# Altium schematic sheet Booster_scheme_transformator.SchDoc
size 420 x 297 mm; DocumentNumber: Введите номер платы + Э3; SheetNumber: номер страницы; Format: A3
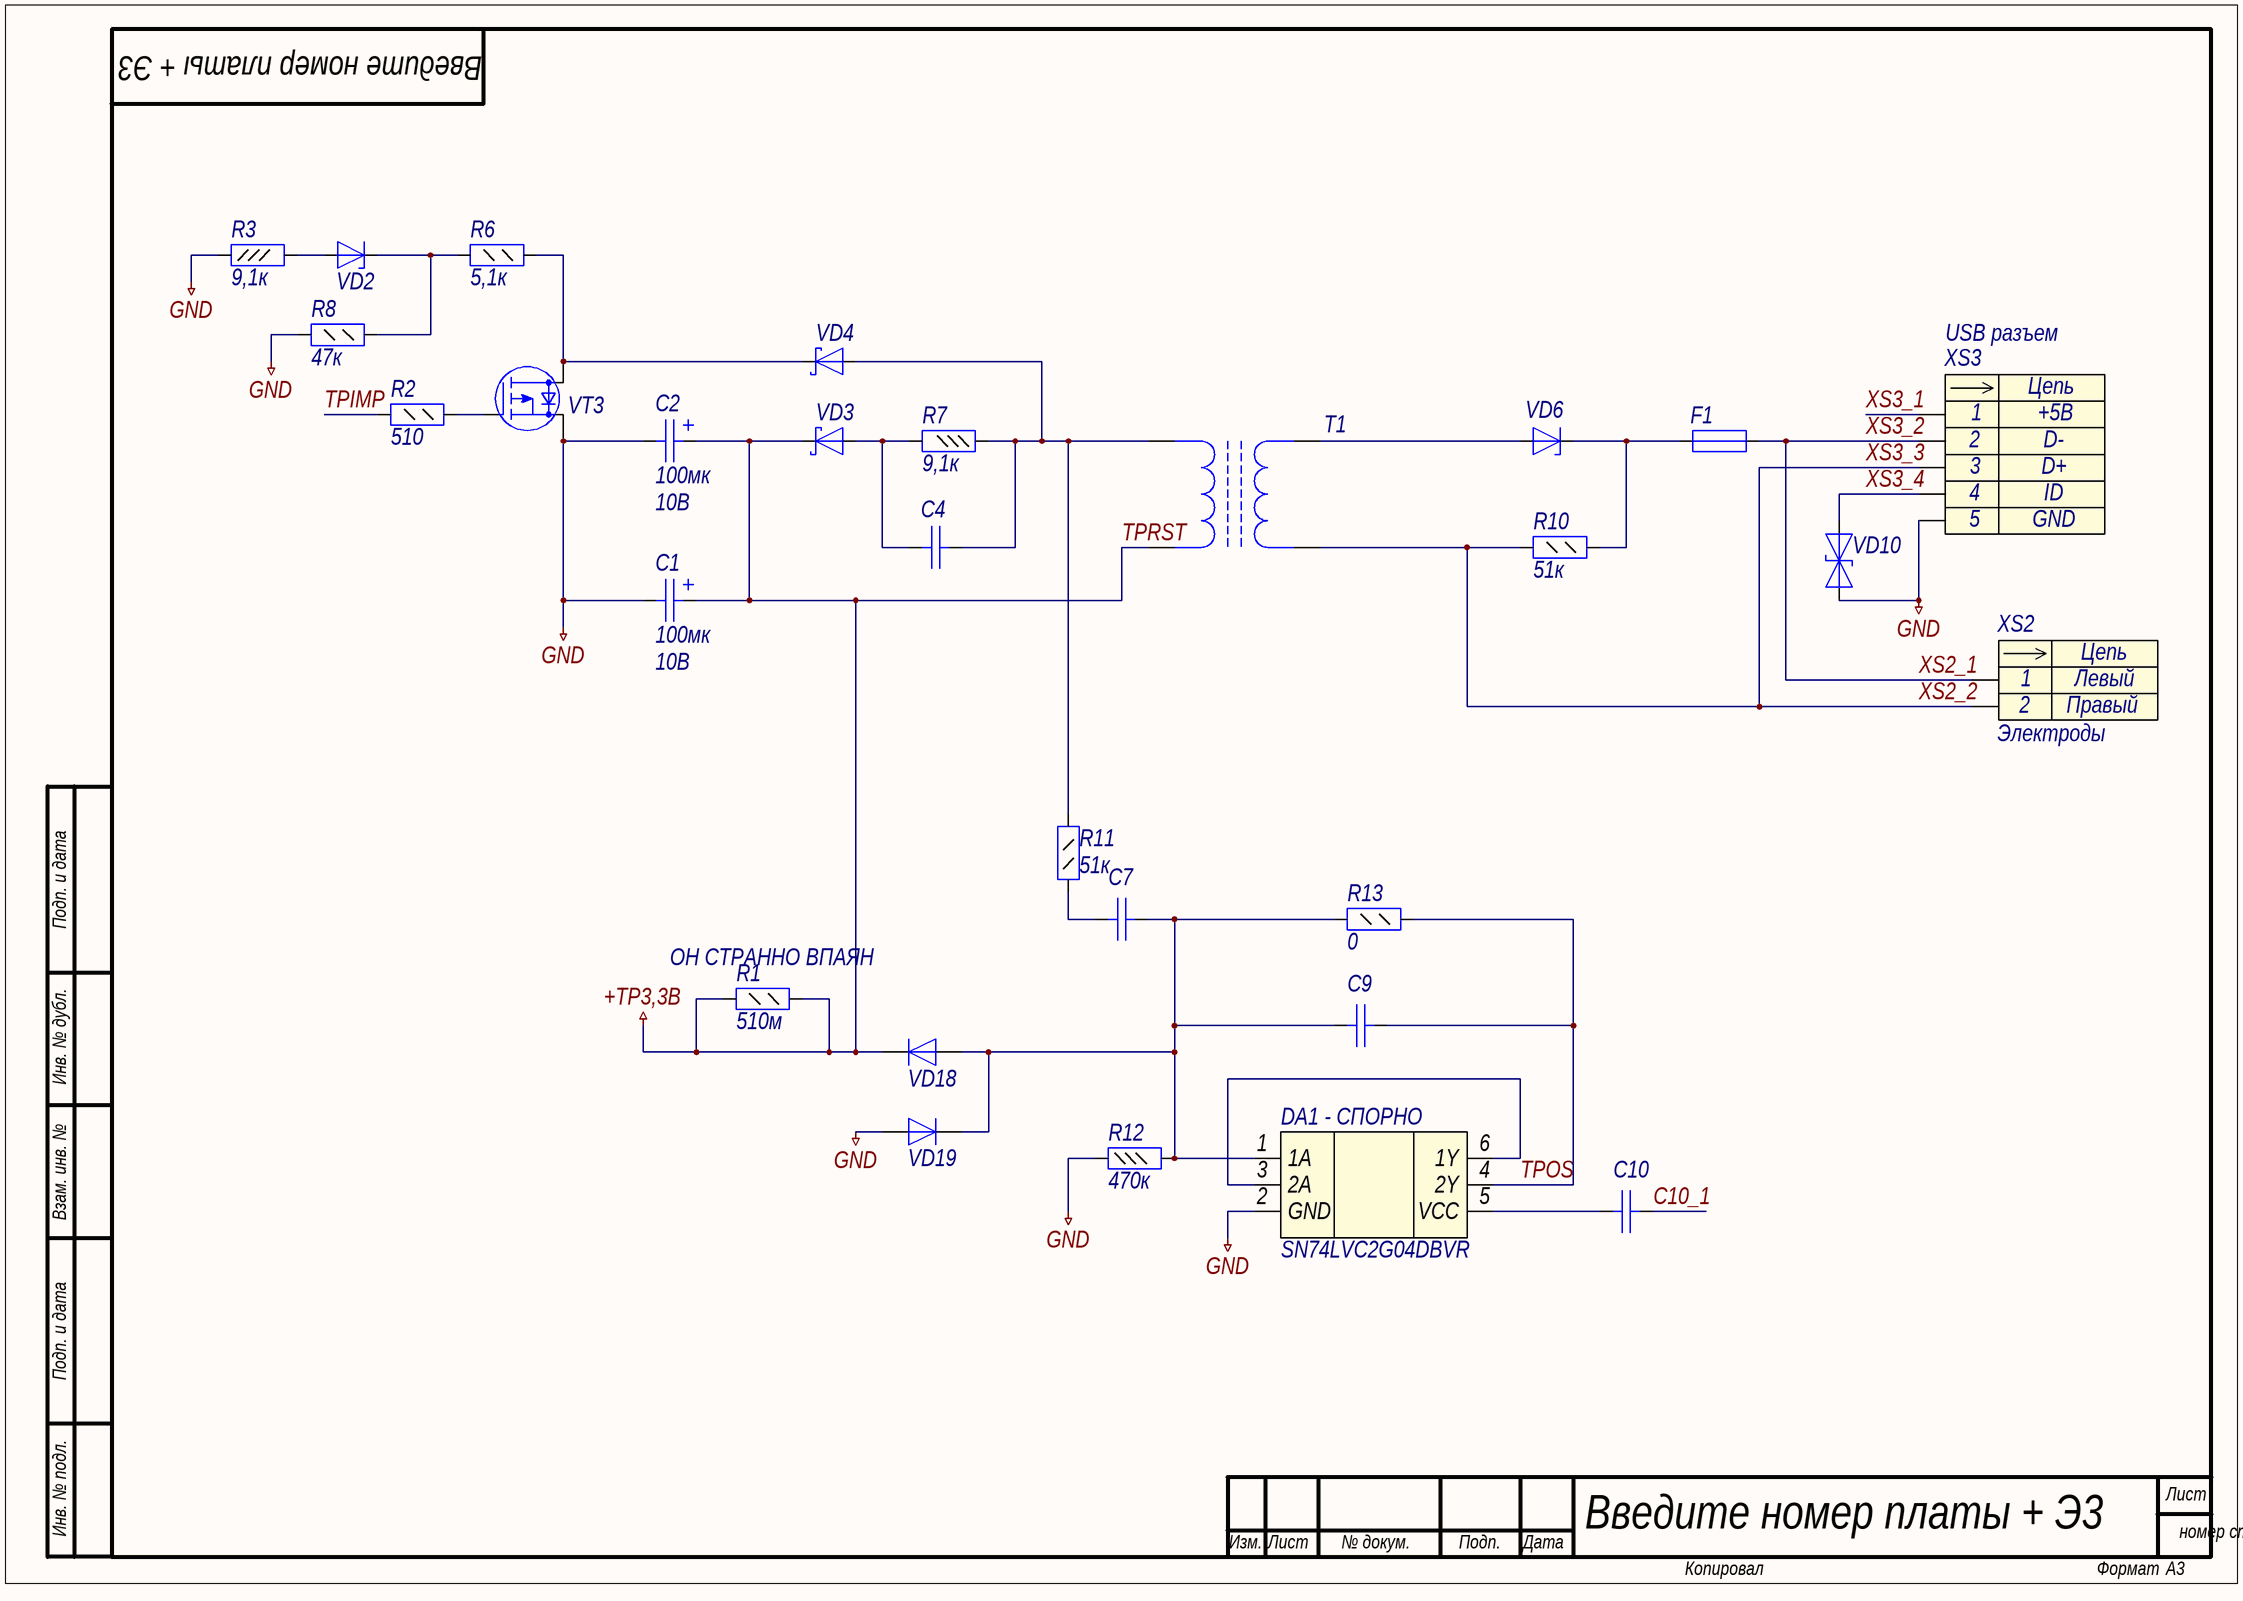
[diagram p0: Booster_scheme_transformator.SchDoc]

## Parts
C1  value 100мк  Voltage: 10В  [TANTAL CASE D]  (hidden comment: Capacitor_pol)
C2  value 100мк  Voltage: 10В  [TANTAL CASE D]  (hidden comment: Capacitor_pol)
C4  Capacitor  [C0402]  (value not drawn)
C7  Capacitor  [C0402]  (value not drawn)
C9  Capacitor  [C0402]  (value not drawn)
C10  Capacitor  [C0402]  (value not drawn)
DA1_-_СПОРНО  SN74LVC2G04DBVR  [SOT23-6]
F1  Fuse  [FUSE812]  (value not drawn)
R1  value 510м  [R0805]  (hidden comment: Resistor_0,125Вт)
R2  value 510  [R0805]  (hidden comment: Resistor_0,125Вт)
R3  value 9,1к  [R0603]  (hidden comment: Resistor_0,062Вт)
R6  value 5,1к  [R0805]  (hidden comment: Resistor_0,125Вт)
R7  value 9,1к  [R0603]  (hidden comment: Resistor_0,062Вт)
R8  value 47к  [R0805]  (hidden comment: Resistor_0,125Вт)
R10  value 51к  [R0805]  (hidden comment: Resistor_0,125Вт)
R11  value 51к  [R0805]  (hidden comment: Resistor_0,125Вт)
R12  value 470к  [R0603]  (hidden comment: Resistor_0,062Вт)
R13  value 0  [R0805]  (hidden comment: Resistor_0,125Вт)
T1  Transformer  [Transformer36mm]  (value not drawn)
VD2  DiodeZener  [SOT23-3]  (value not drawn)
VD3  DiodeSchottky  [SOD-123]  (value not drawn)
VD4  DiodeSchottky  [SOD-123]  (value not drawn)
VD6  DiodeZener  [SOT23-3]  (value not drawn)
VD10  DiodeZenerDual  [SMB]  (value not drawn)
VD18  Diode  [SOD-123]  (value not drawn)
VD19  Diode  [SOD-123]  (value not drawn)
VT3  P-MOSFET  [SOT23-3]  (value not drawn)
XS2  Электроды  [CWF-2]
XS3  USB разъем  [USB MINI AB RECEPTACLE]

## Nets
GND: C1.2 C2.2 DA1_-_СПОРНО.2(GND) R3.1 R8.2 R12.1 VD10.1(K) VD19.2(A) VT3.3(S) XS3.5
TPRST: C1.1 C2.1 R1.1 R1.2 T1.2 VD3.1(K) VD18.1(K)  [also labelled +TP3,3В]
C10_1: C10.1
TPIMP: R2.2
TPOS: C9.2 DA1_-_СПОРНО.4(2Y) R13.1
XS2_1: F1.1 XS2.1 XS3.2  [also labelled XS3_2]
XS2_2: R10.2 T1.4 XS2.2 XS3.3  [also labelled XS3_3]
XS3_1: XS3.1
XS3_4: VD10.2(A) XS3.4
NetC4_1: C4.1 R7.1 R11.2 T1.1 VD4.2(A)
NetC4_2: C4.2 R7.2 VD3.2(A)
NetC7_1: C7.1 C9.1 DA1_-_СПОРНО.1(1A) R12.2 R13.2 VD18.2(A) VD19.1(K)
NetC7_2: C7.2 R11.1
NetC10_2: C10.2 DA1_-_СПОРНО.5(VCC)
NetDA1_-_СПОРНО_3: DA1_-_СПОРНО.3(2A) DA1_-_СПОРНО.6(1Y)
NetF1_2: F1.2 R10.1 VD6.1(K)
NetR2_1: R2.1 VT3.1(G)
NetR3_2: R3.2 VD2.2(A)
NetR6_1: R6.1 VD4.1(K) VT3.2(D)
NetR6_2: R6.2 R8.1 VD2.1(K)
NetT1_3: T1.3 VD6.2(A)

## Notes on the sheet
- Подп. и дата
- (near R1) ОН СТРАННО ВПАЯН
- Инв. № дубл.
- Взам. инв. №
- Инв. № подл.
- Лист
- Изм.
- № докум.
- Подп.
- Дата
- Копировал
- Формат
- (in symbol connect15) Цепь
- (in symbol connect48) Цепь; +5В

## Library data of the parts
C1 C2 = cap233: Конденсатор полярный; Part Name: Tantal; Manufacture: Kemet; Part Number: T495D107K010ATA080; id: cap233
C4 C7 C9 C10 = cap0: Конденсатор; Part Name: Ceramic; Manufacture: Murata; Part Number: GRP1555C1HR47CZ01E; Voltage: 50B; id: cap0; TKE: NP0; Value: ?
DA1_-_СПОРНО = logic12: Инвертирующий Триггер Шмитта; Part Name: Schmitt trigger inverter CMOS; Manufacture: Texas Instruments; Type of Logic: NO; Number of elements: 2; Logic High Level: 1,7-2B; Logic Low Level: 0,7-0,8В; Power Supply: 1,65В-5,5B; id: logic12; Part Number: SN74LVC2G04DBVR
F1 = fuse8: Предохранитель; Part Name: Resettable Fuses; Manufacture: Bourns; Part Number: MF-MSMF050; id: fuse8; V max: 15B; I max: 100A; I hold: 0,5A; I trip: 1A; Resistance: 0,15Ohms
R1 R2 = res66: Резистор; Manufacture: Yageo; Part Number: RC0805FR-07510RL; id: res66; Accuracy: 0.01; Part Name: Resistor; Power: 0,125Вт
R3 R7 = res482: Резистор; Manufacture: Yageo; Part Number: RC0603FR-079K1; id: res482; Accuracy: 1%; Part Name: Resistor; Power: 0,062Вт
R6 = res90: Резистор; Manufacture: Yageo; Part Number: RC0805FR-075K1; id: res90; Accuracy: 0.01; Part Name: Resistor; Power: 0,125Вт
R8 = res113: Резистор; Manufacture: Yageo; Part Number: RC0805FR-0747KL; id: res113; Accuracy: 0.01; Part Name: Resistor; Power: 0,125Вт
R10 R11 = res114: Резистор; Manufacture: Yageo; Part Number: RC0805FR-0751KL; id: res114; Accuracy: 0.01; Part Name: Resistor; Power: 0,125Вт
R12 = res523: Резистор; Manufacture: Yageo; Part Number: RC0603FR-07470KL; id: res523; Accuracy: 1%; Part Name: Resistor; Power: 0,062Вт
R13 = res0: Резистор; Manufacture: Yageo; Part Number: RC0805FR-070RL; id: res0; Accuracy: 1%; Part Name: Resistor; Power: 0,125Вт
T1 = ind3: EMI Suppression Filter; Part Name: transformer cup; id: ind3
VD2 = diode18: Cтабилитрон (лавинный выпрямительный диод) односторонний; Part Number: BZX84-C30; Manufacture: Nexperia; Max Reverse Voltage: 32В; Forward Voltage: 0,6B; Forward Current: 10mA; Breakdown Current: 2mA; Capacitance: 50pF; Number of Channels: 1; id: diode18; Part Name: Diode Zener; Breakdown Voltage: 32В
VD3 VD4 = diode15: Диод Шоттки; Part Number: MBR0540; Manufacture: ON Semiconductor; Max Reverse Voltage: 40B; Forward Voltage: 0,62B; Forward Current: 0,5А; Capacitance: 30pF; Number of Channels: 1; id: diode15; Part Name: Diode Schottky
VD6 = diode17: Cтабилитрон (лавинный выпрямительный диод) односторонний; Part Number: BZX84-C5V1; Manufacture: Nexperia; Max Reverse Voltage: 5,4B; Forward Voltage: 0,6B; Forward Current: 10mA; Breakdown Current: 5mA; Capacitance: 300pF; Number of Channels: 1; id: diode17; Part Name: Diode Zener; Breakdown Voltage: 5,4B
VD10 = SMBJ8.5CA: Cтабилитрон (диод выпрямительный лавинный) двусторонний; Part Name: TVS diode Bidirectional; Manufacture: ST Microelectronics; id: tvs43; Leakage Current: 0,2uA; Stand-off Voltage: 8,5B; Breakdown Voltage: 9,9B; Clamping voltage: 14,4B; Dynamic resistance: 0,096Ohm; Peak Pulse Power: 600W; Number of diodes: 1; Part Number: SMBJ8.5CA
VD18 VD19 = diode20: Диод; Part Number: MMSD4148; Manufacture: ON Semiconductor; Max Reverse Voltage: 100B; Forward Voltage: 1B; Forward Current: 10mA; Breakdown Current: 100uA; Reverse Recovery time: 4ns; Capacitance: 4pF; Number of Channels: 1; id: diode20; Part Name: Diode; Breakdown Voltage: 100B
VT3 = trans5: N-MOSFET; Part Number: IRLML2244TRPbF; Manufacturer: International Rectifier; id: trans5; Structure: p-channel; V drain-source max: (-20B); Rds: 0,054Ohm; Gate-to-source voltage: (+-)12B; Continuous drain current: (-4,3)A; Pulsed drain current: (-18)A; Power dissipation: 1,3W
XS2 = connect15: Разъем - 2 конт. вилка; Part Number: DS1069-2MVW6X; Manufacture: Ningbo connfly electronic; Contact_1: Левый; Contact_2: Правый; Etch: 2,5mm; Name: Электроды; Part Name: CWF-2; id: connect15
XS3 = connect48: USB Mini Type AB Receptacle; Part Name: Mini-USB AB Receptacle; Part Number: UJ2-MABH-1-SMT-TR; Manufacture: CUI; Contact_1: VCC; Contact_2: D-; Contact_3: D+; Contact_4: ID; Contact_5: GND; id: connect48